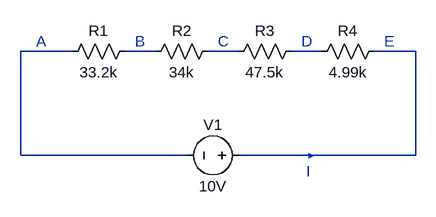
[diagram p0: schematic LAB 1 DESIGN.asc]
LAB 1 DESIGN.asc, the LTspice schematic file:
Version 4
SHEET 1 880 680
WIRE -144 160 -224 160
WIRE -16 160 -64 160
WIRE 112 160 64 160
WIRE 240 160 192 160
WIRE 384 160 320 160
WIRE -224 320 -224 160
WIRE 32 320 -224 320
WIRE 384 320 384 160
WIRE 384 320 112 320
SYMBOL Res 80 144 R90
WINDOW 0 0 56 VBottom 2
WINDOW 3 32 56 VTop 2
SYMATTR InstName R2
SYMATTR Value 34k
SYMBOL Res 208 144 R90
WINDOW 0 0 56 VBottom 2
WINDOW 3 32 56 VTop 2
SYMATTR InstName R3
SYMATTR Value 47.5k
SYMBOL Res 336 144 R90
WINDOW 0 0 56 VBottom 2
WINDOW 3 32 56 VTop 2
SYMATTR InstName R4
SYMATTR Value 4.99k
SYMBOL Res -48 144 R90
WINDOW 0 0 56 VBottom 2
WINDOW 3 32 56 VTop 2
SYMATTR InstName R1
SYMATTR Value 33.2k
SYMBOL voltage 128 320 R90
WINDOW 0 -32 56 VBottom 2
WINDOW 3 32 56 VTop 2
SYMATTR InstName V1
SYMATTR Value 10V
TEXT -200 144 Left 2 ;A
TEXT -48 144 Left 2 ;B
TEXT 80 144 Left 2 ;C
TEXT 208 144 Left 2 ;D
TEXT 336 144 Left 2 ;E
TEXT 216 320 Left 1 ;►
TEXT 216 344 Left 2 ;I

The netlist it stands for:
* LAB 1 DESIGN.asc
R2 N003 N002 34k
R3 N004 N003 47.5k
R4 N005 N004 4.99k
R1 N002 N001 33.2k
V1 N005 N001 10V
* A
* B
* C
* D
* E
* ►
* I
.backanno
.end